# Altium schematic sheet sat-smd.SchDoc
size A4; Organization: Arribada Initiative; Address1: https://github.com/arribada; Address2: contact@arribada.org; Address3: arribada.org; Address4: UK - Portsmouth; DocumentNumber: 13; SheetNumber: 12; SheetTotal: 12
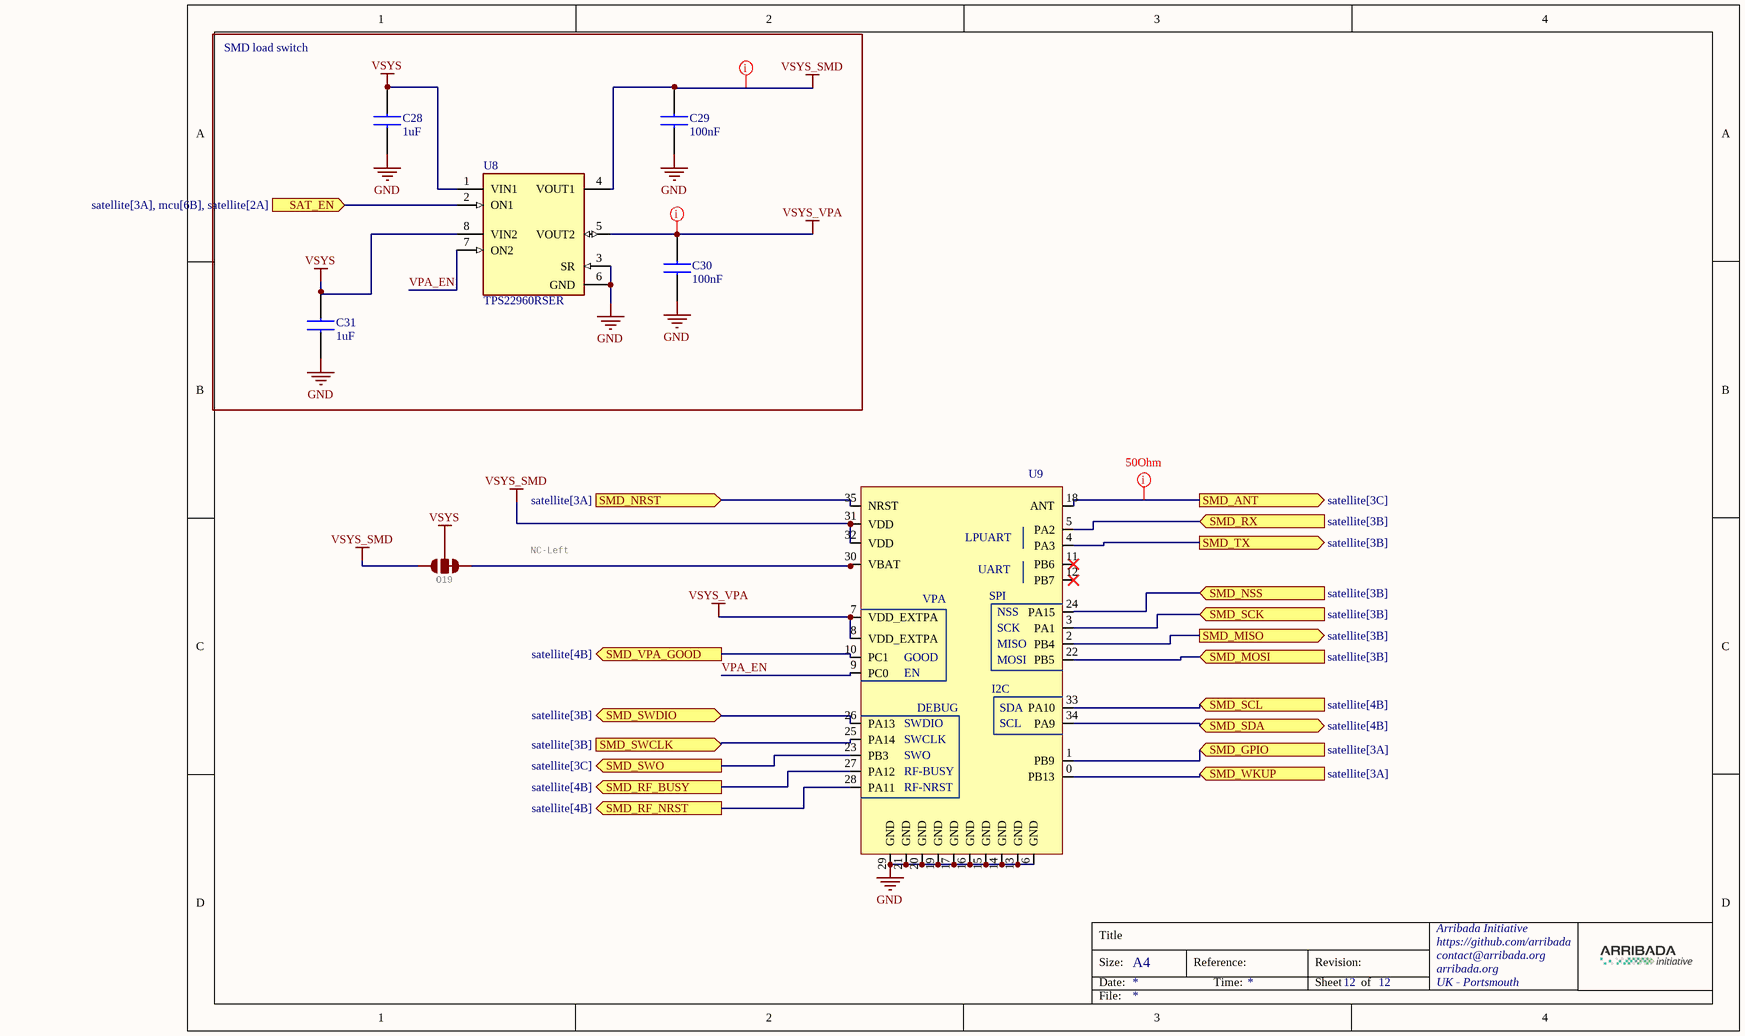
[diagram p0: sat-smd.SchDoc]

## Parts
C28  1uF  [CAPC1005X55N]
C29  value 100nF  [0402]  (hidden comment: GRM155R71C104KA88D)
C30  value 100nF  [0402]  (hidden comment: GRM155R71C104KA88D)
C31  1uF  [CAPC1005X55N]
O19  NC-Left  [SMT-JUMPER_3_2-NCLEFT_TRACE_SILK]  (net tie, no BOM)
U8  TPS22960RSER  [TPS22960RSER]
U9  stm32wl-SMD  [stm32wl-SMD_noLegs]  (value not drawn)

## Blocks framed on the sheet
SMD load switch: C28-C31 U8

## Ports
SAT_EN (in, see satellite[3A], mcu[6B], satellite[2A]), SMD_ANT (out, see satellite[3C]), SMD_GPIO (in, see satellite[3A]), SMD_MISO (out, see satellite[3B]), SMD_MOSI (in, see satellite[3B]), SMD_NRST (in, see satellite[3A]), SMD_NSS (in, see satellite[3B]), SMD_RF_BUSY (out, see satellite[4B]), SMD_RF_NRST (out, see satellite[4B]), SMD_RX (in, see satellite[3B]), SMD_SCK (in, see satellite[3B]), SMD_SCL (in, see satellite[4B]), SMD_SDA (bidir, see satellite[4B]), SMD_SWCLK (in, see satellite[3B]), SMD_SWDIO (bidir, see satellite[3B]), SMD_SWO (out, see satellite[3C]), SMD_TX (out, see satellite[3B]), SMD_VPA_GOOD (out, see satellite[4B]), SMD_WKUP (in, see satellite[3A])

## Nets
GND: C28.1 C29.2 C30.2 C31.1 U8.3(SR) U8.6(GND) U9.6(GND) U9.13(GND) U9.14(GND) U9.15(GND) U9.16(GND) U9.17(GND) U9.19(GND) U9.20(GND) U9.21(GND) U9.29(GND)
VSYS: C28.2 C31.2 O19.2 U8.1(VIN1) U8.8(VIN2)
VSYS_SMD: C29.1 O19.3 U8.4(VOUT1) U9.31(VDD) U9.32(VDD)
VSYS_VPA: C30.1 U8.5(VOUT2) U9.7(VDD_EXTPA) U9.8(VDD_EXTPA)
SAT_EN: U8.2(ON1) ; port SAT_EN
SMD_ANT: U9.18(ANT) ; port SMD_ANT
SMD_GPIO: U9.1(PB9) ; port SMD_GPIO
SMD_MISO: U9.2(PB4) ; port SMD_MISO
SMD_MOSI: U9.22(PB5) ; port SMD_MOSI
SMD_NRST: U9.35(NRST) ; port SMD_NRST
SMD_NSS: U9.24(PA15) ; port SMD_NSS
SMD_RF_BUSY: U9.27(PA12) ; port SMD_RF_BUSY
SMD_RF_NRST: U9.28(PA11) ; port SMD_RF_NRST
SMD_RX: U9.5(PA2) ; port SMD_RX
SMD_SCK: U9.3(PA1) ; port SMD_SCK
SMD_SCL: U9.33(PA10) ; port SMD_SCL
SMD_SDA: U9.34(PA9) ; port SMD_SDA
SMD_SWCLK: U9.25(PA14) ; port SMD_SWCLK
SMD_SWDIO: U9.26(PA13) ; port SMD_SWDIO
SMD_SWO: U9.23(PB3) ; port SMD_SWO
SMD_TX: U9.4(PA3) ; port SMD_TX
SMD_VPA_GOOD: U9.10(PC1) ; port SMD_VPA_GOOD
SMD_WKUP: U9.0(PB13) ; port SMD_WKUP
VPA_EN: U8.7(ON2) U9.9(PC0)
NetO19_1: O19.1 U9.30(VBAT)

Not connected (* = marked no-connect by the designer): U9 11(PB6)* 12(PB7)*

## Layout directives
net class Power: VSYS_SMD, VSYS_VPA
rule Impedance Constraint [Min = 48.00    Max = 52.00    ]; net class 50R_Net: SMD_ANT

## Notes on the sheet
- Title
- Size:
- Date:
- A4
- Reference:
- Time:
- Revision:
- Sheet
- of
- File:
- (in symbol stm32wl-SMD) LPUART; UART; VPA; SPI; NSS; SCK; MISO; GOOD; MOSI; EN; I2C; DEBUG; SDA; SWDIO; SCL; SWCLK; SWO; RF-BUSY; RF-NRST

## Library data of the parts
C28 C31 = GRM155Z71A105KE01J: Multilayer Ceramic Capacitors MLCC - SMD/SMT 1.0UF 10V 10% 0402; Manufacturer_Name: Murata Electronics; Manufacturer 1: Murata; Description 1: Multi-Layer Ceramic Capacitor 1uF X7R 10% 0402 Paper T/R; Datasheet Link: http://www.murata.com/~/media/webrenewal/support/library/catalog/products/capacitor/mlcc/c02e.pdf; Height: 0.55mm; Manufacturer_Part_Number: GRM155Z71A105KE01J; Mouser Part Number: 81-GRM155Z71A105KE1J; Mouser Price/Stock: https://www.mouser.co.uk/ProductDetail/Murata-Electronics/GRM155Z71A105KE01J?qs=xZ%2FP%252Ba9zWqaF%2FmyRgV0iOA%3D%3D; Arrow Part Number: GRM155Z71A105KE01J; Arrow Price/Stock: https://www.arrow.com/en/products/grm155z71a105ke01j/murata-manufacturing?region=nac; Supplier 1: Mouser; Supplier Part Number 1: 81-GRM155Z71A105KE1J; Manufacturer Part Number 1: GRM155Z71A105KE01J; RoHS 1: Yes; Category 1: Ceramic Capacitors; Stock 1: 804340; Pricing 1: 1=0,1, 10=0,069, 50=0,069, 100=0,031, 1000=0,018, 10000=0,013 (USD); Supplier 2: Digi-Key; Supplier Part Number 2: 490-GRM155Z71A105KE01JCT-ND; Manufacturer 2: Murata; Manufacturer Part Number 2: GRM155Z71A105KE01J; RoHS 2: Yes; Description 2: Multi-Layer Ceramic Capacitor 1uF X7R 10% 0402 Paper T/R; Category 2: Ceramic Capacitors; Stock 2: 80025; Pricing 2: 1=0,1, 10=0,063, 50=0,0344, 100=0,0281, 500=0,02006, 1000=0,01577, 2500=0,01433, 5000=0,01319 (USD); Value: 1uF
C29 C30 = GRM155R71C104KA88D: Multilayer Ceramic Capacitors MLCC - SMD/SMT 0.1 uF 16 VDC 10% 0402 X7R; Manufacturer_Part_Number: CC0402KRX7R7BB104; Manufacturer: YAGEO; Manufacturer 1: Murata; Description 1: 0402 0.1 uF 16V ±10 % Tolerance X7R SMT Multilayer Ceramic Capacitor; Voltage Rating: 16V; Package: C0402; Supplier 1: Mouser; Supplier Part Number 1: 81-GRM155R71C104KA88; Manufacturer Part Number 1: GRM155R71C104KA88D; RoHS 1: Yes; Category 1: Ceramic Capacitors; Stock 1: 7816691; Pricing 1: 1=0,1, 10=0,017, 50=0,017, 100=0,01, 1000=0,008, 10000=0,005 (USD); Mount: Surface Mount; Case/Package: 0402; Number of Pins: 2; Case Code (Metric): 1005; Case Code (Imperial): 0402; Material: Ceramic; Dielectric Material: Ceramic; Min Operating Temperature: -55°C; Max Operating Temperature: 125°C; Capacitance: 100nF; Tolerance: 10%; Packaging: Tape and Reel; Voltage Rating (DC): 16V; Package Quantity: 1; Dielectric: X7R; Termination: SMD/SMT; Voltage: 16V; Series: GRM; Length: 1mm; Width: 0.02inch; Height: 0.5mm; Thickness: 0.022inch; Depth: 0.5mm; Radiation Hardening: No; Lead Free: Lead Free; RoHS Compliant: Yes; Reach SVHC Compliant: Unknown; ComponentLink1URL: https://datasheet.ciiva.com/129/grm155r71c104ka88-01-129739.pdf?src-supplier=Digi-Key; ComponentLink1Description: https://datasheet.ciiva.com/129/grm155r71c104ka88-01-129739.pdf?src-supplier=Digi-Key; ComponentLink2URL: https://datasheet.ciiva.com/129/grm155r71c104ka88-01-129740.pdf?src-supplier=Digi-Key; ComponentLink2Description: https://datasheet.ciiva.com/129/grm155r71c104ka88-01-129740.pdf?src-supplier=Digi-Key; ComponentLink3URL: https://datasheet.ciiva.com/29199/454098-da-01-en-vs-kondensator-0402-29199799.pdf?src-supplier=Conrad; ComponentLink3Description: https://datasheet.ciiva.com/29199/454098-da-01-en-vs-kondensator-0402-29199799.pdf?src-supplier=Conrad; ComponentLink4URL: https://datasheet.ciiva.com/7937/4360-7937615.pdf?src-supplier=Element14; ComponentLink4Description: https://datasheet.ciiva.com/7937/4360-7937615.pdf?src-supplier=Element14; ComponentLink5URL: https://datasheet.ciiva.com/14116/grmseries-highdielectrictype-eng-14116878.pdf?src-supplier=Distrelec; ComponentLink5Description: https://datasheet.ciiva.com/14116/grmseries-highdielectrictype-eng-14116878.pdf?src-supplier=Distrelec; ComponentLink6URL: https://datasheet.ciiva.com/14103/grmseries-highdielectrictype-eng-14103750.pdf?src-supplier=Distrelec; ComponentLink6Description: https://datasheet.ciiva.com/14103/grmseries-highdielectrictype-eng-14103750.pdf?src-supplier=Distrelec; ComponentLink7URL: https://datasheet.ciiva.com/28534/4360-28534127.pdf?src-supplier=Element14; ComponentLink7Description: https://datasheet.ciiva.com/28534/4360-28534127.pdf?src-supplier=Element14; ComponentLink8URL: https://datasheet.ciiva.com/28534/4360-28534133.pdf?src-supplier=Element14; ComponentLink8Description: https://datasheet.ciiva.com/28534/4360-28534133.pdf?src-supplier=Element14
O19 = JUMPER-SMT_3_2-NCLEFT_TRACE_SILK: Normally opened lefttrace jumper (1 of 2 connections)    This jumper has a trace between left pad pads so they are normally closed (NC). Use a razor knife to open the connection(s). For best results follow the IPC guidelines for cutting traces: Cutout at least 0.063 mm (0.005 in).  Remove all loose material to clean up the cut area.  Seal the cut with an approved epoxy.       Reapply solder to reclose the connection(s).; GateName_1: G$1; SymbolName_1: SMT-JUMPER_3_2-NC_TRACE; DeviceName: _SILK; DeviceSetName: JUMPER-SMT_3_2-NC_TRACE; LibraryName: SparkFun-Jumpers
U8 = TPS22960RSER: Power Switch ICs - Power Distribution Low Input VTG Dual L oad Switch; Manufacturer_Name: Texas Instruments; Datasheet Link: https://www.ti.com/lit/ds/symlink/tps22960.pdf?ts=1638681846865&ref_url=https%253A%252F%252Fwww.google.com%252F; Height: 0.6mm; Manufacturer_Part_Number: TPS22960RSER; Mouser Part Number: 595-TPS22960RSER; Mouser Price/Stock: https://www.mouser.co.uk/ProductDetail/Texas-Instruments/TPS22960RSER?qs=EQxOuqCyzqQpKHLEcq5RSg%3D%3D; Arrow Part Number: TPS22960RSER; Arrow Price/Stock: https://www.arrow.com/en/products/tps22960rser/texas-instruments?region=nac
U9 = stm32wl-SMD: Arribada SMD module Argos comunication with PA GR5504